# EAGLE design RedBoard-v06 (EAGLE 6.91.2)
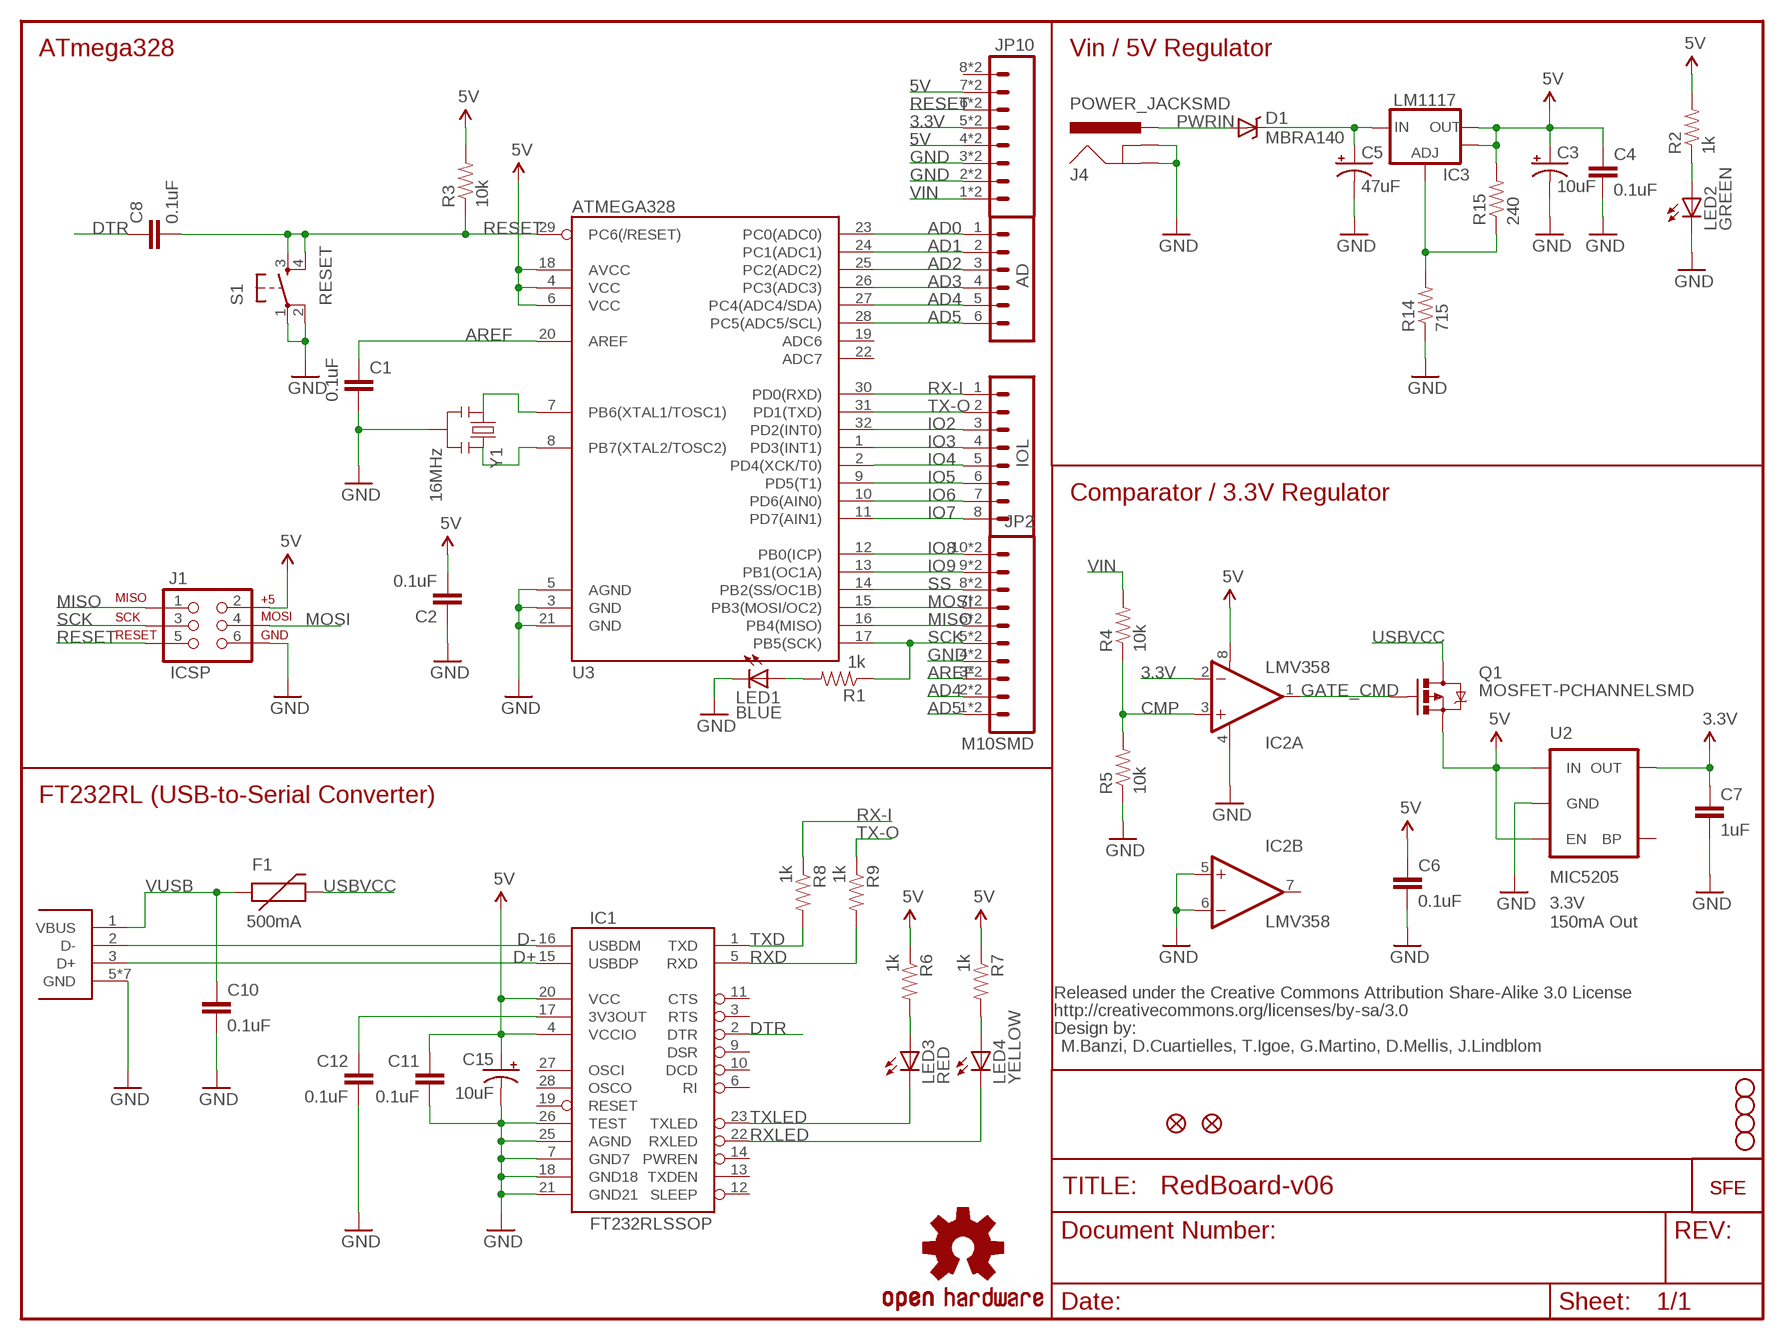
[diagram p0: schematic, sheet 1]

## Parts
AD  M06SMD-STRAIGHT-COMBO  [1X06_SMD_STRAIGHT_COMBO]
C1  0.1uF  CAP0402-CAP  [0402-CAP]
C2  0.1uF  CAP0402-CAP  [0402-CAP]
C3  10uF  CAP_POL1206  [EIA3216]
C4  0.1uF  CAP0402-CAP  [0402-CAP]
C5  47uF  CAP_POLD  [PANASONIC_D]
C6  0.1uF  CAP0402-CAP  [0402-CAP]
C7  1uF  CAP0402-CAP  [0402-CAP]
C8  0.1uF  CAP0402-CAP  [0402-CAP]
C10  0.1uF  CAP0402-CAP  [0402-CAP]
C11  0.1uF  CAP0402-CAP  [0402-CAP]
C12  0.1uF  CAP0402-CAP  [0402-CAP]
C15  10uF  CAP_POL1206  [EIA3216]
D1  MBRA140  DIODE-SCHOTTKY_  [SMA-DIODE]
F1  500mA  PTCSMD  [PTC-1206]
IC1  FT232RLSSOP  [SSOP28DB]
IC2  LMV358  OPAMP-DUALU  [SO08]
IC3  LM1117  V_REG_LM1117ALT1  [SOT223-ALT1]
IOL  M08SMD-COMBO  [1X08_SMD_COMBINED]
J1  ICSP  AVR_SPI_PRG_6PTH  [2X3]
J4  POWER_JACKSMD  [POWER_JACK_SMD]
JP1  LOGO-SFENW2  [SFE-NEW-WEB]
JP2  M10SMD  [1X10_SMD_COMBINED]
JP3  STAND-OFF  [STAND-OFF]
JP4  STAND-OFF  [STAND-OFF]
JP5  STAND-OFF  [STAND-OFF]
JP6  STAND-OFF  [STAND-OFF]
JP7  LOGO-SFESK  [SFE-LOGO-FLAME]
JP8  FIDUCIAL1X2  [FIDUCIAL-1X2]
JP9  FIDUCIAL1X2  [FIDUCIAL-1X2]
JP10  M08SMD-COMBO  [1X08_SMD_COMBINED]
LED1  BLUE  LED0603  [LED-0603]
LED2  GREEN  LED0603  [LED-0603]
LED3  RED  LED0603  [LED-0603]
LED4  YELLOW  LED0603  [LED-0603]
Q1  MOSFET-PCHANNELSMD  [SOT23-3]
R1  1k  RESISTOR0402-RES  [0402-RES]
R2  1k  RESISTOR0402-RES  [0402-RES]
R3  10k  RESISTOR0402-RES  [0402-RES]
R4  10k  RESISTOR0402-RES  [0402-RES]
R5  10k  RESISTOR0402-RES  [0402-RES]
R6  1k  RESISTOR0402-RES  [0402-RES]
R7  1k  RESISTOR0402-RES  [0402-RES]
R8  1k  RESISTOR0402-RES  [0402-RES]
R9  1k  RESISTOR0402-RES  [0402-RES]
R14  715  RESISTOR0402-RES  [0402-RES]
R15  240  RESISTOR0402-RES  [0402-RES]
S1  RESET  TAC_SWITCHSMD  [TACTILE_SWITCH_SMD]
U2  MIC5205  V_REG_LDOSMD  [SOT23-5]
U3  ATMEGA328  ATMEGA168  [TQFP32-08]
U$14  USB_MICROB_JSTGCT  [USB_MICROB_3075]
U$15  CREATIVE_COMMONS  [CREATIVE_COMMONS]
U$16  OSHW-LOGOS  [OSHW-LOGO-S]
Y1  16MHz  RESONATORSMD  [RESONATOR-SMD]

## Nets
3.3V: C7.1 IC2.2(A:-IN) JP10.5 JP10.5@2 U2.5(OUT)
5V: C2.2 C3.A(+) C4.1 C6.1 C11.1 C15.A(+) IC1.4(VCCIO) IC1.20(VCC) IC2.8(A:V+) IC3.2(OUT) IC3.4(OUT) J1.2 JP10.4 JP10.4@2 JP10.7 JP10.7@2 Q1.2(S) R2.2 R3.2 R6.1 R7.1 R15.2 U2.1(IN) U2.3(EN) U3.4(VCC) U3.6(VCC) U3.18(AVCC)
AD0: AD.1 U3.23(PC0(ADC0))
AD1: AD.2 U3.24(PC1(ADC1))
AD2: AD.3 U3.25(PC2(ADC2))
AD3: AD.4 U3.26(PC3(ADC3))
AD4: AD.5 JP2.2 JP2.2@2 U3.27(PC4(ADC4/SDA))
AD5: AD.6 JP2.1 JP2.1@2 U3.28(PC5(ADC5/SCL))
AREF: C1.1 JP2.3 JP2.3@2 U3.20(AREF)
CMP: IC2.3(A:+IN) R4.1 R5.2
D+: IC1.15(USBDP) U$14.3(D+)
D-: IC1.16(USBDM) U$14.2(D-)
DTR: C8.1 IC1.2(DTR)
GATE_CMD: IC2.1(A:OUT) Q1.1(G)
GND: C1.2 C2.1 C3.C(-) C4.2 C5.- C6.2 C7.2 C10.2 C11.2 C12.2 C15.C(-) IC1.7(GND7) IC1.18(GND18) IC1.21(GND21) IC1.25(AGND) IC1.26(TEST) IC2.4(A:V-) IC2.5(B:+IN) IC2.6(B:-IN) J1.6 J4.GND(GNDBREAK) J4.P$4(GND) JP2.4 JP2.4@2 JP10.2 JP10.2@2 JP10.3 JP10.3@2 LED1.C LED2.C R5.1 R14.1 S1.1 S1.2 U2.2(GND) U3.3(GND) U3.5(AGND) U3.21(GND) U$14.5(GND) U$14.P$1(GND) U$14.P$2(GND) U$14.P$3(GND) U$14.P$4(GND) U$14.P$8(GND) U$14.P$10(GND) Y1.2
IO2: IOL.3 U3.32(PD2(INT0))
IO3: IOL.4 U3.1(PD3(INT1))
IO4: IOL.5 U3.2(PD4(XCK/T0))
IO5: IOL.6 U3.9(PD5(T1))
IO6: IOL.7 U3.10(PD6(AIN0))
IO7: IOL.8 U3.11(PD7(AIN1))
IO8: JP2.10 JP2.10@2 U3.12(PB0(ICP))
IO9: JP2.9 JP2.9@2 U3.13(PB1(OC1A))
MISO: J1.1 JP2.6 JP2.6@2 U3.16(PB4(MISO))
MOSI: J1.4 JP2.7 JP2.7@2 U3.15(PB3(MOSI/OC2))
N$1: LED1.A R1.2
N$2: LED2.A R2.1
N$3: U3.7(PB6(XTAL1/TOSC1)) Y1.1
N$4: U3.8(PB7(XTAL2/TOSC2)) Y1.3
N$5: C12.1 IC1.17(3V3OUT)
N$8: LED3.A R6.2
N$10: LED4.A R7.2
N$15: IC3.1(ADJ) R14.2 R15.1
PWRIN: D1.A J4.VIN0(PWR)
RESET: C8.2 J1.5 JP10.6 JP10.6@2 R3.1 S1.3 S1.4 U3.29(PC6(/RESET))
RX-I: IOL.1 R8.1 U3.30(PD0(RXD))
RXD: IC1.5(RXD) R9.2
RXLED: IC1.22(RXLED) LED4.C
SCK: J1.3 JP2.5 JP2.5@2 R1.1 U3.17(PB5(SCK))
SS: JP2.8 JP2.8@2 U3.14(PB2(SS/OC1B))
TX-O: IOL.2 R9.1 U3.31(PD1(TXD))
TXD: IC1.1(TXD) R8.2
TXLED: IC1.23(TXLED) LED3.C
USBVCC: F1.2 Q1.3(D)
VIN: C5.+ D1.C IC3.3(IN) JP10.1 JP10.1@2 R4.2
VUSB: C10.1 F1.1 U$14.1(VBUS)
Unconnected: IC1.3(RTS) IC1.6(RI) IC1.9(DSR) IC1.10(DCD) IC1.11(CTS) IC1.12(SLEEP) IC1.13(TXDEN) IC1.14(PWREN) IC1.19(RESET) IC1.27(OSCI) IC1.28(OSCO) IC2.7(B:OUT) JP10.8 JP10.8@2 U2.4(BP) U3.19(ADC6) U3.22(ADC7)

## Notes on the sheet
- ATmega328 | Vin / 5V Regulator
- Comparator / 3.3V Regulator
- FT232RL (USB-to-Serial Converter)
- 3.3V
  150mA Out
- M.Banzi, D.Cuartielles, T.Igoe, G.Martino, D.Mellis, J.Lindblom

## Library data of the parts
AD = SparkFun:M06: Header 6 Standard 6-pin 0.1" header. Use with straight break away headers (SKU : PRT-00116), right angle break away headers (PRT-00553), swiss pins (PRT-00743), machine pins (PRT-00117), and female headers (PRT-00115). Molex polarized connector foot print use with SKU : PRT-08094 with associated crimp pins and housings. NOTES ON THE VARIANTS LOCK and LOCK_LONGPADS... This footprint was designed to help hold the alignment of a through-hole component (i.e. 6-pin header) while soldering it into place. You may notice that each hole has been shifted either up or down by 0.005 of an inch from it's more standard position (which is a perfectly straight line). This slight alteration caused the pins (the squares in the middle) to touch the edges of the holes. Because they are alternating, it causes a "brace" to hold the component in place. 0.005 has proven to be the perfect amount of "off-center" position when using our standard breakaway headers. Although looks a little odd when you look at the bare footprint, once you have a header in there, the alteration is very hard to notice. Also, if you push a header all the way into place, it is covered up entirely on the bottom side. This idea of altering the position of holes to aid alignment will be further integrated into the Sparkfun Library for other footprints. It can help hold any component with 3 or more connection pins.
C1 C2 C4 C6-C8 C10 C12 = SparkFun:CAP: Capacitor Standard 0603 ceramic capacitor, and 0.1" leaded capacitor.
C3 C5 = SparkFun:CAP_POL: Capacitor Polarized These are standard SMD and PTH capacitors. Normally 10uF, 47uF, and 100uF in electrolytic and tantalum varieties. Always verify the external diameter of the through hole cap, it varies with capacity, voltage, and manufacturer. The EIA devices should be standard.
C11 = SparkFun-Capacitors:CAP: Capacitor Standard 0603 ceramic capacitor, and 0.1" leaded capacitor.
C15 = SparkFun-Capacitors:CAP_POL: Capacitor Polarized These are standard SMD and PTH capacitors. Normally 10uF, 47uF, and 100uF in electrolytic and tantalum varieties. Always verify the external diameter of the through hole cap, it varies with capacity, voltage, and manufacturer. The EIA devices should be standard.
D1 = SparkFun:DIODE-SCHOTTKY
F1 = SparkFun:PTC: Resettable Fuse PTC Resettable Fuse. Spark Fun Electronics SKU : COM-08357
IC1 = SparkFun-DigitalIC:FT232RL: USB UART FT232RL 4th Generation USB UART (USB <-> Serial) Controller. Spark Fun Electronics SKU : COM-00650
IC2 = SparkFun:OPAMP-DUAL: Operational Amplifier
IC3 = Testing:V_REG_LM1117: Voltage Regulator LM1117 Standard adjustable voltage regulator but in SMD form. Spark Fun Electronics SKU : COM-00595
IOL = SparkFun:M08: Header 8 Standard 8-pin 0.1" header. Use with straight break away headers (SKU : PRT-00116), right angle break away headers (PRT-00553), swiss pins (PRT-00743), machine pins (PRT-00117), and female headers (PRT-00115).
J1 = SparkFun:AVR_SPI_PRG_6: AVR ISP 6 Pin This is the reduced ISP connector for AVR programming. Common on Arduino. This footprint will take up less PCB space and can be used with a 10-pin to 6-pin adapter such as SKU: BOB-08508
J4 = SparkFun:POWER_JACK: Power Jack This is the standard 5.5mm barrel jack for power. The PTH is the most common, proven, reliable, footprint. All others are experimental. The Slot footprint only works if the mill layer is transmitted to the PCB fab house so be warned. Spark Fun Electronics SKU : PRT-00119. Mating wall wart : TOL-00298 (and others)
JP1 JP7 = SparkFun-Aesthetics:LOGO-SFE: Spark Fun Electronics PCB Logo This is the standard Spark Fun Electronics PCB logo.
JP2 = SparkFun-Connectors:M10: Header 10 Standard 10-pin 0.1" header. Use with straight break away headers (SKU : PRT-00116), right angle break away headers (PRT-00553), swiss pins (PRT-00743), machine pins (PRT-00117), and female headers (PRT-00115).
JP3-JP6 = SparkFun:STAND-OFF: Stand Off This is the mechanical footprint for a #4 phillips button head screw. Use the keepout ring to avoid running the screw head into surrounding components. SKU : PRT-00447
JP8 JP9 = SparkFun:FIDUCIAL: Fiducial Alignment Points Various fiducial points for machine vision alignment.
JP10 = SparkFun-Connectors:M08: Header 8 Standard 8-pin 0.1" header. Use with straight break away headers (SKU : PRT-00116), right angle break away headers (PRT-00553), swiss pins (PRT-00743), machine pins (PRT-00117), and female headers (PRT-00115).
LED1-LED4 = SparkFun:LED: LEDs Standard schematic elements and footprints for 5mm, 3mm, 1206, and 0603 sized LEDs. 5mm - Spark Fun Electronics SKU : COM-00529 (and others)
Q1 = SparkFun:MOSFET-PCHANNEL
R1-R9 R14 R15 = SparkFun:RESISTOR: Resistor Basic schematic elements and footprints for 0603, 1206, and PTH resistors.
S1 = SparkFun:TAC_SWITCH: Momentary Switch Button commonly used for reset or general input. Spark Fun Electronics SKU : COM-00097
U2 = SparkFun:V_REG_LDO: Voltage Regulator LDO Standard 150mA LDO voltage regulator in SOT-23 layout. Micrel part MIC5205. BP (by-pass) pin is used to lower output noise with 470pF cap.
U3 = SparkFun:ATMEGA168
U$14 = KwanSystems:USB_MICROB_JST
U$15 = SparkFun:CREATIVE_COMMONS
U$16 = SparkFun-Aesthetics:OSHW-LOGO: Open Source Hardware Logo This logo indicates the piece of hardware it is found on incorporates a OSHW license and/or adheres to the definition of open source hardware found here: http://freedomdefined.org/OSHW
Y1 = SparkFun-FreqCtrl:RESONATOR: Resonator Small SMD resonator. This is the itty bitty 10/20MHz resonators with built in caps. CSTCE10M0G55 and CSTCE20M0V53. Footprint has been reviewed closely but hasn't been tested yet.

## Net classes
0 default: width 0.152 mm, drill 0.305 mm, clearance 0.152 mm

## Board
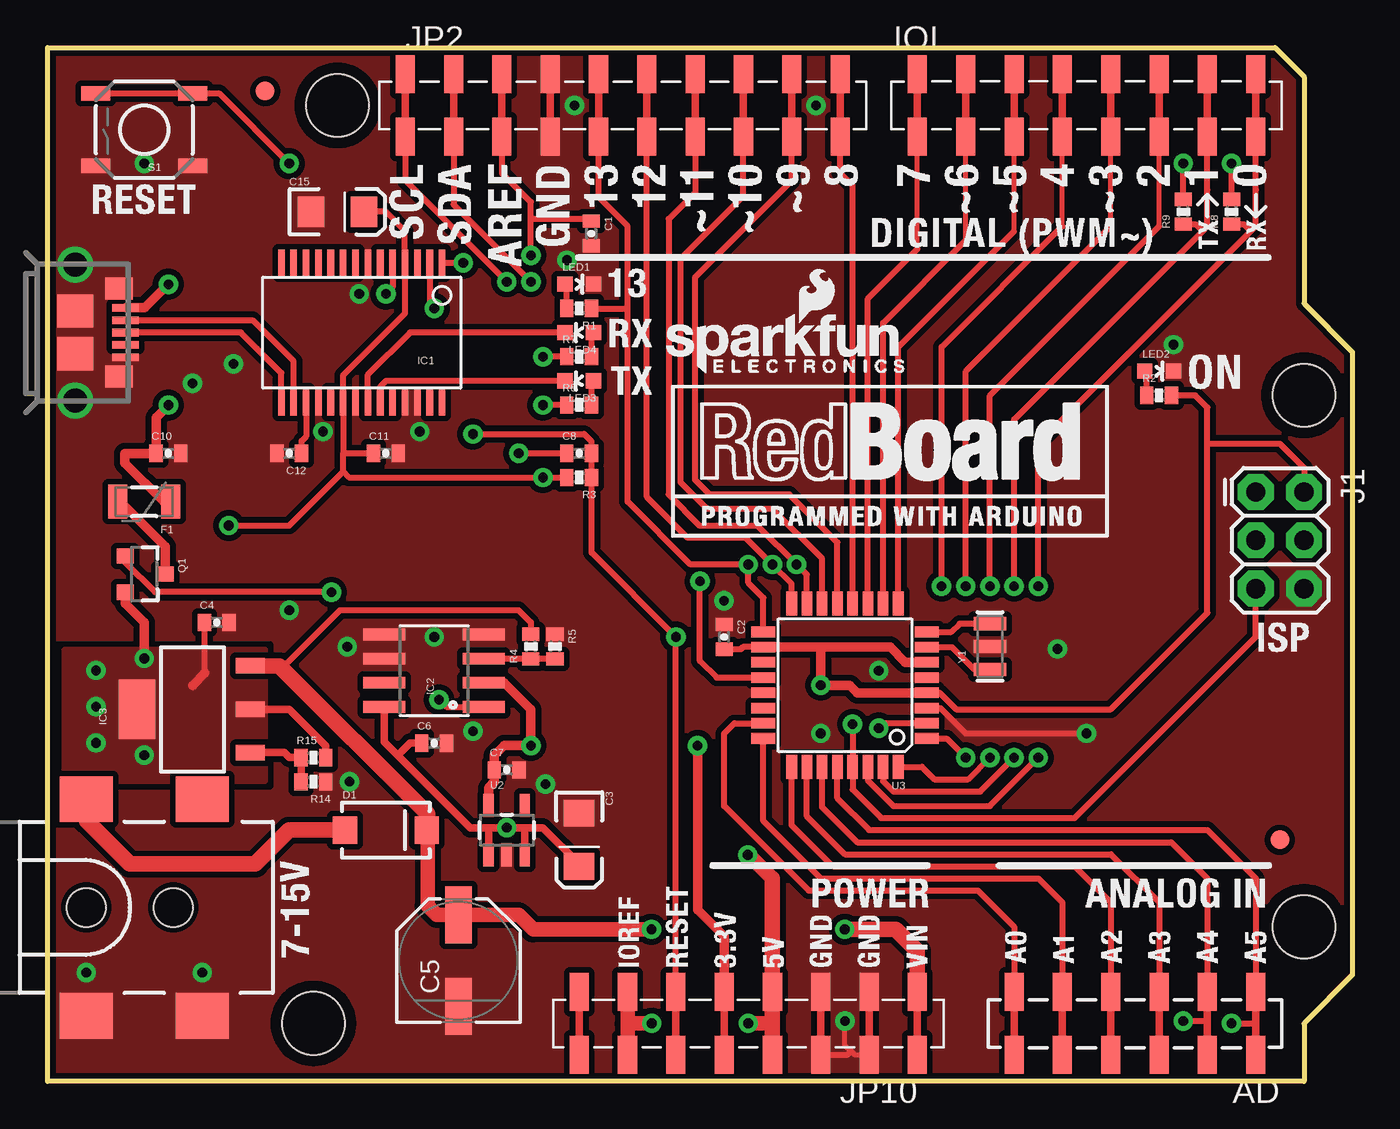
[diagram p1: board, top side]
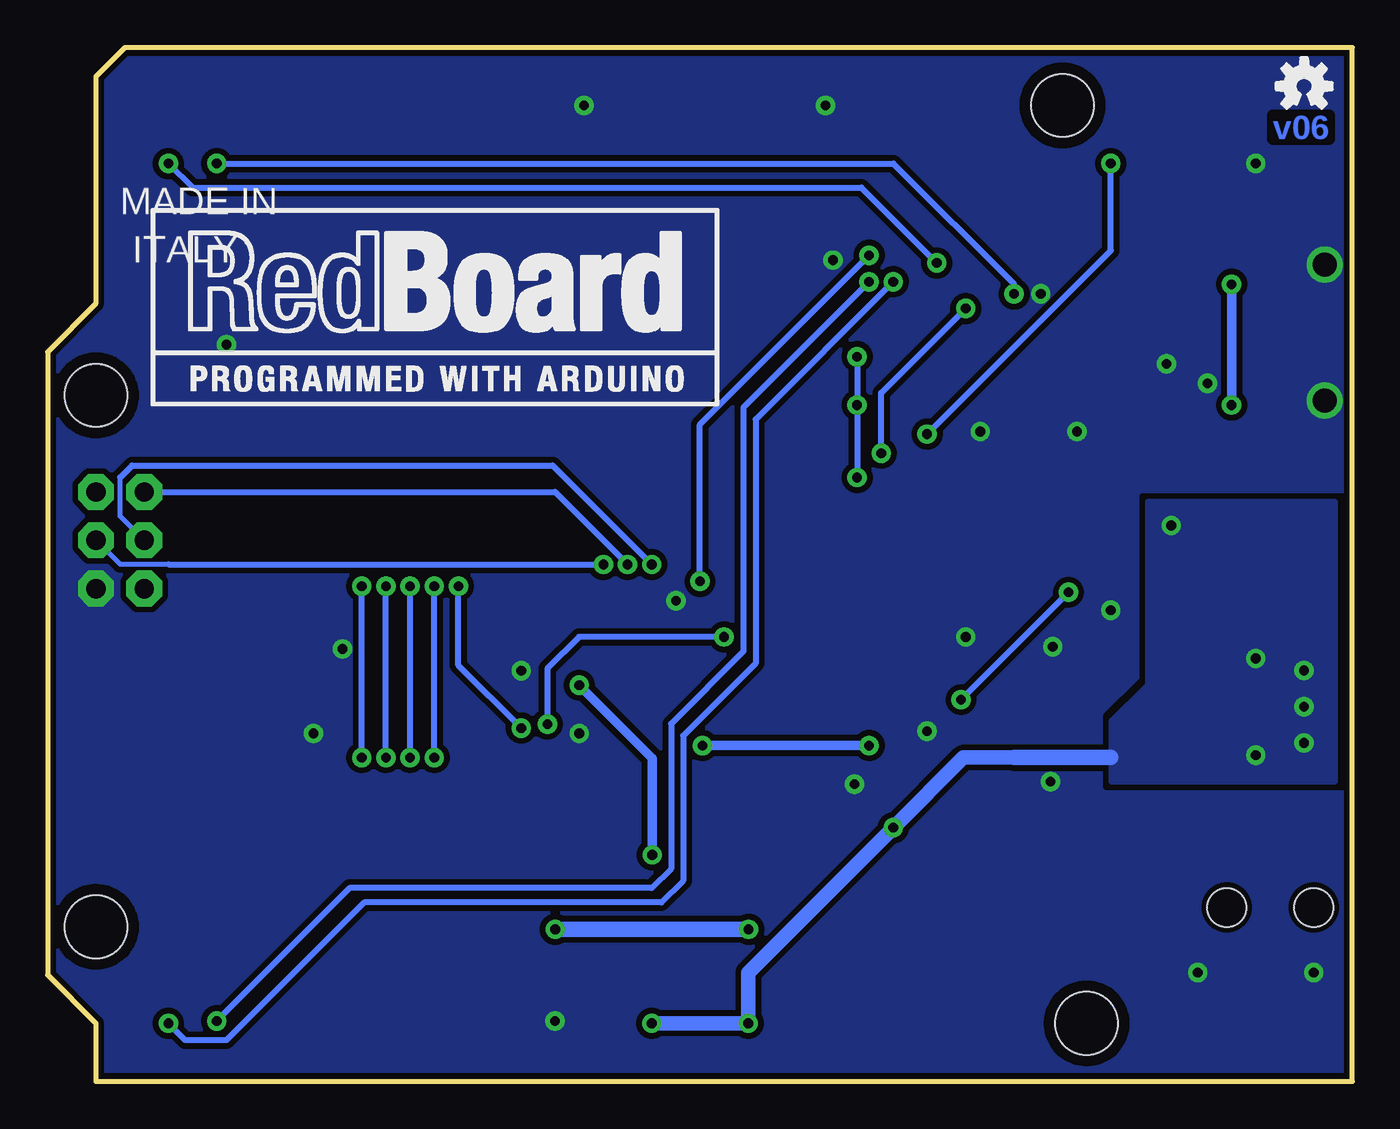
[diagram p2: board, bottom side, seen from below]

Size 68.58 x 54.36 mm. Coordinates in mm from the lower left corner, seen from the top.
Outline: 0,54.36 64.52,54.36 66.04,52.83 66.04,40.89 68.58,38.35 68.58,5.59 66.04,3.05 66.04,0 0,0 0,54.36
Copper layers (1*16): Top 0.035mm / dielectric 1.5mm / Bottom 0.035mm
Design rules "default": minimum track width 8mil, minimum drill 20mil, track to track 8mil, track to pad 8mil, pad to pad 8mil, via to via 8mil, smd to smd 8mil, copper to edge 8mil, drill to drill 8mil, minimum pad ring 12mil, minimum via ring 10mil, stop-mask expansion 4mil, vias tented up to drill 20mil, thermal gap 10mil
vRestrict: area 0.6,22.4 to 2,30.6; area 5.7,23.1 to 7.4,30.6; area 47.9,10.8 to 48.5,11.3; area 50.4,10.7 to 50.9,11.6; area 11.3,29.3 to 12.7,31.6; area 0.3,13 to 9.4,25

### Footprints (pad centres in the part's own frame; a part is rotated, then mirrored left to right if it is on the bottom)
1X06_SMD_STRAIGHT_COMBO = smd 1 x 2: 1 0,1.65; 1-2 0,-1.65; 2 -2.54,-1.65; 2-2 -2.54,1.65; 3 -5.08,1.65; 3-2 -5.08,-1.65; 4 -7.62,-1.65; 4-2 -7.62,1.65; 5 -10.16,1.65; 5-2 -10.16,-1.65; 6 -12.7,-1.65; 6-2 -12.7,1.65
0402-CAP = smd 0.7 x 0.9: 1 -0.65,0; 2 0.65,0
EIA3216 = smd 1.4 x 1.6: A 1.4,0; C -1.4,0
PANASONIC_D = smd 3 x 1.4: + 2.4,0; - -2.4,0
SMA-DIODE = smd 1.27 x 1.47: A -2.15,0; C 2.15,0
PTC-1206 = smd 1 x 1.8: 1 -1.4,0; 2 1.4,0
SSOP28DB = smd 0.348 x 1.397: 1 -4.225,-3.656; 2 -3.575,-3.656; 3 -2.925,-3.656; 4 -2.275,-3.656; 5 -1.625,-3.656; 6 -0.975,-3.656; 7 -0.325,-3.656; 8 0.325,-3.656; 9 0.975,-3.656; 10 1.625,-3.656; 11 2.275,-3.656; 12 2.925,-3.656; 13 3.575,-3.656; 14 4.225,-3.656; 15 4.225,3.656; 16 3.575,3.656; 17 2.925,3.656; 18 2.275,3.656; 19 1.625,3.656; 20 0.975,3.656; 21 0.325,3.656; 22 -0.325,3.656; 23 -0.975,3.656; 24 -1.625,3.656; 25 -2.275,3.656; 26 -2.925,3.656; 27 -3.575,3.656; 28 -4.225,3.656
SO08 = smd 0.61 x 2.21: 1 -1.905,-2.616; 2 -0.635,-2.616; 3 0.635,-2.616; 4 1.905,-2.616; 5 1.905,2.616; 6 0.635,2.616; 7 -0.635,2.616; 8 -1.905,2.616
SOT223-ALT1 = smd 0.813 x 1.524: 1 -2.271,-3.02; 2 0,-3.02; 3 2.288,-3.02 | smd 3.124 x 1.905: 4 0,2.921
1X08_SMD_COMBINED = smd 1 x 2: 1 0,-1.65; 1@2 0,1.65; 2 -2.54,1.65; 2@2 -2.54,-1.65; 3 -5.08,-1.65; 3@2 -5.08,1.65; 4 -7.62,1.65; 4@2 -7.62,-1.65; 5 -10.16,-1.65; 5@2 -10.16,1.65; 6 -12.7,1.65; 6@2 -12.7,-1.65; 7 -15.24,-1.65; 7@2 -15.24,1.65; 8 -17.78,1.65; 8@2 -17.78,-1.65
2X3 = drill 1.016 pad 1.88 octagon: 1 0,0; 2 0,2.54; 3 2.54,0; 4 2.54,2.54; 5 5.08,0; 6 5.08,2.54
POWER_JACK_SMD = smd 2.8 x 2.4: GND 0,-5.7; P$4 6.1,-5.7; VIN0 0,5.7; VIN1 6.1,5.7 | hole 2.032: 0,0; 4.572,0
1X10_SMD_COMBINED = smd 1 x 2: 1 0,1.65; 1@2 0,-1.65; 2 2.54,-1.65; 2@2 2.54,1.65; 3 5.08,1.65; 3@2 5.08,-1.65; 4 7.62,-1.65; 4@2 7.62,1.65; 5 10.16,1.65; 5@2 10.16,-1.65; 6 12.7,-1.65; 6@2 12.7,1.65; 7 15.24,1.65; 7@2 15.24,-1.65; 8 17.78,-1.65; 8@2 17.78,1.65; 9 20.32,1.65; 9@2 20.32,-1.65; 10 22.86,-1.65; 10@2 22.86,1.65
STAND-OFF = hole 3.302: 0,0
FIDUCIAL-1X2 = smd 1 x 1: 1 0,0
1X08_SMD_COMBINED' = smd 1 x 2: 1 0,1.65; 1@2 0,-1.65; 2 2.54,-1.65; 2@2 2.54,1.65; 3 5.08,1.65; 3@2 5.08,-1.65; 4 7.62,-1.65; 4@2 7.62,1.65; 5 10.16,1.65; 5@2 10.16,-1.65; 6 12.7,-1.65; 6@2 12.7,1.65; 7 15.24,1.65; 7@2 15.24,-1.65; 8 17.78,-1.65; 8@2 17.78,1.65
LED-0603 = smd 0.8 x 0.8: A 0,-0.75; C 0,0.75
SOT23-3 = smd 0.8 x 0.9: 1 -0.95,-1; 2 0.95,-1; 3 0,1.1
0402-RES = smd 0.7 x 0.9: 1 -0.65,0; 2 0.65,0
TACTILE_SWITCH_SMD = smd 1.524 x 0.762: 1 -2.54,1.905; 2 2.54,1.905; 3 -2.54,-1.905; 4 2.54,-1.905
SOT23-5 = smd 0.55 x 1.2: 1 -0.95,-1.3; 2 0,-1.3; 3 0.95,-1.3; 4 0.95,1.3; 5 -0.95,1.3
TQFP32-08 = smd 1.27 x 0.559: 1 -4.293,2.8; 2 -4.293,2; 3 -4.293,1.2; 4 -4.293,0.4; 5 -4.293,-0.4; 6 -4.293,-1.2; 7 -4.293,-2; 8 -4.293,-2.8; 17 4.293,-2.8; 18 4.293,-2; 19 4.293,-1.2; 20 4.293,-0.4; 21 4.293,0.4; 22 4.293,1.2; 23 4.293,2; 24 4.293,2.8 | smd 0.559 x 1.27: 9 -2.8,-4.293; 10 -2,-4.293; 11 -1.2,-4.293; 12 -0.4,-4.293; 13 0.4,-4.293; 14 1.2,-4.293; 15 2,-4.293; 16 2.8,-4.293; 25 2.8,4.293; 26 2,4.293; 27 1.2,4.293; 28 0.4,4.293; 29 -0.4,4.293; 30 -1.2,4.293; 31 -2,4.293; 32 -2.8,4.293
USB_MICROB_3075 = smd 0.4 x 1.4: 1 -1.3,4.1; 2 -0.65,4.1; 3 0,4.1; 4 0.65,4.1; 5 1.3,4.1 | smd 1.15 x 1.45: P$1 2.32,3.75; P$10 -2.32,3.75 | smd 1.75 x 1.9: P$2 1.125,1.45; P$8 -1.125,1.45 | drill 1.25 pad 1.9: P$3 -3.575,1.45; P$4 3.575,1.45
RESONATOR-SMD = smd 0.7 x 1.7: 1 -1.2,0; 2 0,0; 3 1.2,0

### Placement (x,y rotation side)
AD  50.8,3.05 180 top
C1  28.57,44.58 270 top
C2  35.56,23.37 270 top
C3  27.94,12.7 270 top
C4  8.89,24.13 0 top
C5  21.59,6.35 90 top
C6  20.32,17.78 0 top
C7  24.13,16.38 0 top
C8  27.94,33.02 0 top
C10  6.35,33.02 0 top
C11  17.78,33.02 0 top
C12  12.7,33.02 180 top
C15  15.24,45.72 0 top
D1  17.78,13.21 0 top
F1  5.08,30.48 180 top
IC1  16.51,39.37 180 top
IC2  20.32,21.59 90 top
IC3  7.62,19.56 90 top
IOL  63.5,51.31 0 top
J1  63.5,30.99 270 top
J4  2.03,9.14 0 top
JP1  32.51,37.21 0 top
JP2  18.8,51.31 0 top
JP3  13.97,3.05 0 top
JP4  66.04,8.13 0 top
JP5  66.04,36.07 0 top
JP6  15.24,51.31 0 top
JP7  39.5,39.88 0 top
JP8  64.77,12.7 0 top
JP9  11.43,52.07 0 top
JP10  [1X08_SMD_COMBINED']  45.72,3.05 180 top
LED1  27.94,41.91 270 top
LED2  58.42,37.34 270 top
LED3  27.94,36.83 90 top
LED4  27.94,39.37 90 top
Q1  5.08,26.67 270 top
R1  27.94,40.64 180 top
R2  58.42,36.07 0 top
R3  27.94,31.75 180 top
R4  25.4,22.86 90 top
R5  26.67,22.86 270 top
R6  27.94,35.56 0 top
R7  27.94,38.1 0 top
R8  62.23,45.72 90 top
R9  59.69,45.72 90 top
R14  13.97,15.75 180 top
R15  13.97,17.02 0 top
S1  5.08,50.04 180 top
U2  24.13,13.21 0 top
U3  41.91,20.83 180 top
U$14  0,39.37 270 top
U$15  2.54,-8.38 0 top  (outside the outline)
U$16  2.54,52.32 0 bottom
Y1  49.53,22.86 90 top

### Tracks (layer width: path | path; a pad name or v marks a point on that pad's centre or on a via)
3.3V  (via drill 0.51)
  Top 0.305: JP10.5 JP10.5@2
  Top 0.508: U2.5 23.18,15.43 23.48,15.73 C7.1 23.48,17.13 24,17.65 v25.4,17.65 25.4,19.56 24,20.95 IC2.2 | JP10.5@2 35.56,7.62 34.16,9.02 v34.16,17.65
  Bottom 0.508: v25.4,17.65 v34.16,17.65
5V  (via drill 0.51)
  Top 0.305: U3.18 36.54,22.83 36.43,22.72 C2.2 | U3.4 46.88,20.43 47.75,19.56 55.88,19.56 60.96,24.64 60.96,33.53 | J1.2 66.04,32.26 64.77,33.53 60.96,33.53 | 60.96,33.53 60.96,35.43 60.33,36.07 R2.2 | R7.1 v26.04,38.1 | 15.54,33.02 IC1.20 15.54,37.12 18.79,40.38 IC1.4 18.79,44.72 17.78,45.72 C15.A | C11.1 15.54,33.02 | C4.1 8.24,21.51 8.27,21.48 | JP10.4 38.1,2.54 | 15.54,32.06 15.54,33.02 | v9.53,29.22 12.7,29.22 15.54,32.06 | R3.2 v26.04,31.75 15.84,31.75 15.54,32.06 | R6.1 v26.04,35.56
  Top 0.406: U2.1 23.18,13.27 23.11,13.34 | U2.3 25.08,13.27 25.02,13.34 | R15.2 14.62,17.64 12.7,19.56 IC3.2 | IC2.8 17.7,17.86 18.41,17.14 | 18.41,17.14 22.23,13.34 23.11,13.34 | 23.11,13.34 v24.13,13.34 25.02,13.34 | C6.1 19.05,17.78 18.41,17.14 | 25.02,13.34 26.04,13.34 27.94,11.43 C3.A
  Top 0.508: U3.6 45.09,22.03 44.28,22.83 40.64,22.83 | 40.64,22.83 U3.18 | 40.64,22.83 v40.64,20.83 42.16,20.83 42.56,20.43 U3.4 | 8.27,21.48 7.62,20.83 | Q1.2 4.08,25.13 5.08,24.13 v5.08,22.24
  Top 0.762: v36.8,11.91 36.8,11.97 38.1,10.67 | v36.83,3.05 37.85,3.05 38.1,3.3 | v31.75,3.05 30.48,3.05 | 30.48,3.05 JP10.7 | JP10.7@2 30.48,3.05
  Top 0.813: 38.1,10.67 JP10.4 38.1,3.3 38.1,2.54 JP10.4@2
  Bottom 0.305: v26.04,38.1 v26.04,35.56 v26.04,31.75
  Bottom 0.508: v36.8,11.91 36.8,16.99 v40.64,20.83
  Bottom 0.762: v36.83,3.05 v31.75,3.05 31.75,5.71 v24.13,13.34 20.45,17.02 17.78,17.02
  Bottom 0.813: 17.78,17.02 12.7,17.02
  other vias: 2.54,19.7 5.08,17.16 2.54,17.79 2.54,21.6
  pour Bottom (isolate 0.305, no thermals): 0.89,30.48 10.79,30.48 10.79,20.83 12.7,18.92 12.7,15.75 0.89,15.75
  pour Top (isolate 0.305, no thermals): 0.89,15.75 0.89,22.73 11.43,22.73 11.43,15.75
AD0
  Top 0.305: U3.23 36.1,18.83 35.56,18.29 35.56,14.48 40.01,10.03 48.9,10.03 50.8,8.13 AD.1
AD1
  Top 0.305: U3.24 37.62,13.69 40.64,10.67 52.07,10.67 53.34,9.4 AD.2
AD2
  Top 0.305: U3.25 39.11,13.47 41.27,11.3 53.98,11.3 55.88,9.4 AD.3
AD3
  Top 0.305: U3.26 39.91,13.94 41.91,11.94 55.88,11.94 58.42,9.4 AD.4
AD4  (via drill 0.51)
  Top 0.254: JP2.2@2 JP2.2
  Top 0.305: U3.27 40.71,14.41 42.55,12.57 59.05,12.57 60.96,10.67 60.96,3.17 | 60.96,3.17 AD.5 | JP2.2 21.34,46.1 v25.4,42.04 | v59.69,3.17 60.96,3.17
  Bottom 0.305: v25.4,42.04 32,35.43 32,22.61 35.81,18.8 35.81,11.18 36.83,10.16 52.7,10.16 v59.69,3.17
AD5  (via drill 0.51)
  Top 0.254: JP2.1 JP2.1@2
  Top 0.305: U3.28 41.51,14.88 43.18,13.21 60.96,13.21 63.5,10.67 AD.6 63.5,3.05 v62.23,3.05 | JP2.1@2 18.8,47.37 v24.13,42.04
  Bottom 0.305: v24.13,42.04 31.37,34.8 31.37,21.97 35.18,18.16 35.18,10.54 36.32,9.4 51.94,9.4 59.18,2.16 61.34,2.16 v62.23,3.05
AREF  (via drill 0.51)
  Top 0.305: U3.20 35.16,21.23 34.29,22.1 v34.29,26.29 | JP2.3 JP2.3@2 23.88,47.75 25.4,46.23 25.4,45.34 | C1.1 28.46,45.34 25.4,45.34 | v25.4,43.43 25.4,45.34
  Bottom 0.305: v25.4,43.43 34.29,34.54 v34.29,26.29
CMP
  Top 0.305: R5.2 R4.1 25.39,22.23 IC2.3
D+
  Top 0.305: IC1.15 12.29,37.24 10.16,39.37 U$14.3
D-
  Top 0.305: IC1.16 12.94,37.87 10.78,40.02 U$14.2
DTR  (via drill 0.51)
  Top 0.305: IC1.2 20.09,40.88 v20.32,40.64 | C8.1 v24.77,33.02
  Bottom 0.305: v20.32,40.64 24.77,36.2 v24.77,33.02
GATE_CMD  (via drill 0.51)
  Top 0.305: IC2.1 20.95,19.68 v20.57,20.07 | Q1.1 4.08,27.29 5.65,25.72 v14.92,25.72
  Bottom 0.305: v20.57,20.07 v14.92,25.72
GND  (via drill 0.51)
  Top 0.254: JP10.2@2 42.42,1.4 42.23,1.59 41.91,1.91 v41.91,3.17
  Top 0.305: U3.3 46.92,19.63 48.26,18.29 v54.61,18.29 | JP10.3 42.04,1.4 42.23,1.59 | JP2.4@2 JP2.4
  other vias: 20.32,23.37 15.75,22.86 5.08,48.26 15.88,15.75 22.35,18.41 59.18,38.73 26.16,15.62 40.64,18.29 27.69,51.31 43.69,21.59 53.09,22.73 12.7,24.77 35.56,25.27 2.03,5.71 8.13,5.71 14.48,34.16 9.78,37.72 7.62,36.7 16.38,41.4 27.3,43.18 40.39,51.31 19.56,34.16
  pour Top (isolate 0.305, rank 2, no thermals): 0,54.36 68.58,54.36 68.58,0 0,0
  pour Bottom (isolate 0.305, rank 2, no thermals): 0,54.36 68.58,54.36 68.58,0 0,0
IO2  (via drill 0.51)
  Top 0.254: 58.42,44.96 IOL.3
  Top 0.305: 58.42,44.96 49.53,36.07 v49.53,26.04 | U3.32 45.95,16.54 46.61,15.88 48.39,15.88 v49.53,17.02
  Bottom 0.305: v49.53,17.02 v49.53,26.04
IO3  (via drill 0.51)
  Top 0.254: 55.88,44.96 IOL.4
  Top 0.305: 55.88,44.96 48.26,37.34 v48.26,26.04 | U3.1 47.25,18.03 v48.26,17.02
  Bottom 0.305: v48.26,17.02 v48.26,26.04
IO4  (via drill 0.51)
  Top 0.254: 53.34,44.96 IOL.5
  Top 0.305: 53.34,44.96 46.99,38.61 v46.99,26.04 | U3.2 43.94,18.83 v43.69,18.57
  Bottom 0.305: v43.69,18.57 46.99,21.88 v46.99,26.04
IO5
  Top 0.254: 50.8,44.7 IOL.6
  Top 0.305: U3.9 44.71,38.61 50.8,44.7
IO6
  Top 0.254: 48.26,44.23 IOL.7
  Top 0.305: U3.10 43.91,39.88 48.26,44.23
IO7
  Top 0.254: 45.72,43.76 IOL.8
  Top 0.305: U3.11 43.11,41.15 45.72,43.76
IO8
  Top 0.305: U3.12 42.31,47.1 41.66,47.75 JP2.10 JP2.10@2
IO9
  Top 0.305: JP2.9 JP2.9@2 39.12,47.35 34.04,42.27 34.04,31.62 34.8,30.86 38.99,30.86 41.51,28.34 U3.13
MISO  (via drill 0.51)
  Top 0.305: U3.16 39.11,26.17 v38.1,27.18 36.7,28.57 33.66,28.57 31.5,30.73 JP2.6 JP2.6@2
  Bottom 0.305: J1.1 41.91,30.99 v38.1,27.18
MOSI  (via drill 0.51)
  Top 0.305: U3.15 39.91,26.64 v39.37,27.18 37.34,29.21 34.29,29.21 32.64,30.86 32.64,45.34 34.04,46.74 JP2.7@2 JP2.7
  Bottom 0.254: 62.23,27.18 64.77,27.18 J1.4
  Bottom 0.305: 62.23,27.18 v39.37,27.18
N$1
  Top 0.305: R1.2 27.29,41.81 LED1.A
N$2
  Top 0.305: R2.1 57.77,37.24 LED2.A
N$3
  Top 0.305: U3.7 47.53,22.83 48.7,21.66 Y1.1
N$4
  Top 0.305: U3.8 47.5,23.63 47.94,24.06 Y1.3
N$5
  Top 0.305: IC1.17 13.59,33.91 13.35,33.67 C12.1
N$8
  Top 0.305: R6.2 28.59,36.73 LED3.A
N$10
  Top 0.305: R7.2 28.59,39.27 LED4.A
N$15
  Top 0.406: R14.2 R15.1 12.7,17.02 12.43,17.29 IC3.1
PWRIN
  Top 0.813: D1.A 12.7,13.21 10.92,11.43 4.32,11.43 2.03,13.72 J4.VIN0
RESET  (via drill 0.51)
  Top 0.305: J1.5 63.5,23.37 53.98,13.84 43.81,13.84 42.31,15.35 U3.29 v42.31,18.78 | S1.4 S1.3 9.02,51.94 v12.7,48.26 | JP10.6@2 JP10.6 v33.02,23.37 28.59,27.8 R3.1 C8.2 28.59,33.64 28.19,34.04 v22.35,34.04
  Bottom 0.305: v42.31,18.78 42.31,21.7 40.64,23.37 v33.02,23.37 | v22.35,34.04 12.7,43.69 v12.7,48.26
RX-I  (via drill 0.51)
  Top 0.254: 63.5,46.86 63.52,46.88
  Top 0.305: IOL.1 63.5,46.86 63.5,44.96 63.25,44.7 | U3.30 43.11,15.82 44.45,14.48 49.53,14.48 v52.07,17.02 | 63.25,44.7 52.07,33.53 v52.07,26.04 | R8.1 62.88,45.07 63.25,44.7
  Bottom 0.305: v52.07,17.02 v52.07,26.04
RXD  (via drill 0.51)
  Top 0.305: R9.2 v59.69,48.26 | IC1.5 18.14,41.76 v17.78,41.4
  Bottom 0.305: v59.69,48.26 24.13,48.26 17.78,41.91 v17.78,41.4
RXLED
  Top 0.305: IC1.22 16.84,37.16 19.05,39.37 LED4.C
SCK  (via drill 0.51)
  Top 0.305: U3.17 37.62,25.43 36.83,26.21 v36.83,27.18 33.78,27.18 30.48,30.48 30.48,40.64 | JP2.5 JP2.5@2 28.96,46.48 30.48,44.96 30.48,40.64 | R1.1 30.48,40.64
  Bottom 0.254: J1.3 64.77,29.72 64.77,31.75
  Bottom 0.305: 64.77,31.75 64.14,32.38 42.04,32.38 v36.83,27.18
SS
  Top 0.305: JP2.8@2 JP2.8 36.58,46.55 33.27,43.25 33.27,31.5 34.67,30.1 38.1,30.1 40.71,27.49 U3.14
TX-O  (via drill 0.51)
  Top 0.254: 60.96,46.86 60.95,46.88
  Top 0.305: U3.31 43.91,15.78 44.45,15.24 49.02,15.24 v50.8,17.02 | IOL.2 60.96,46.86 60.96,44.96 60.71,44.7 | v50.8,26.04 50.8,34.8 60.71,44.7 | R9.1 60.34,45.07 60.71,44.7
  Bottom 0.305: v50.8,17.02 v50.8,26.04
TXD  (via drill 0.51)
  Top 0.305: v21.84,43.03 IC1.1 | R8.2 v62.23,48.26
  Bottom 0.305: v62.23,48.26 60.96,46.99 25.81,46.99 v21.84,43.03
TXLED
  Top 0.305: LED3.C 17.78,36.83 17.48,36.53 IC1.23
USBVCC
  Top 0.508: Q1.3 6.18,28.11 3.81,30.48 F1.2
VIN  (via drill 0.51)
  Top 0.305: 12.19,21.85 12.45,21.85 15.38,24.78 24.75,24.78 25.4,24.13 R4.2 | JP10.1 JP10.1@2
  Top 0.762: v31.74,7.99 25.52,7.99 24.76,8.75 C5.+ 20.46,8.75 19.98,9.23 19.98,13.16
  Top 0.813: 19.98,13.16 D1.C 19.98,13.26 19.98,14.06 12.19,21.85 IC3.3 | v41.9,7.99 44.59,7.99 45.72,6.86 JP10.1@2
  Bottom 0.813: v31.74,7.99 v41.9,7.99
VUSB  (via drill 0.51)
  Top 0.508: F1.1 6.1,30.48 4.06,32.51 4.06,33.02 C10.1 5.7,34.91 v6.35,35.56 | v6.35,41.91 5.11,40.67 U$14.1
  Bottom 0.508: v6.35,35.56 v6.35,41.91

### Text on the board
Bottom: v06
tNames: D.Mellis | G.Martino | T.Igoe | D.Cuartielles | M.Banzi | J.Lindblom
bNames: MADE IN | ITALY
200bmp: R
214bmp: D:/SmartProjects/Snc/a4_bn_logo2.bmp